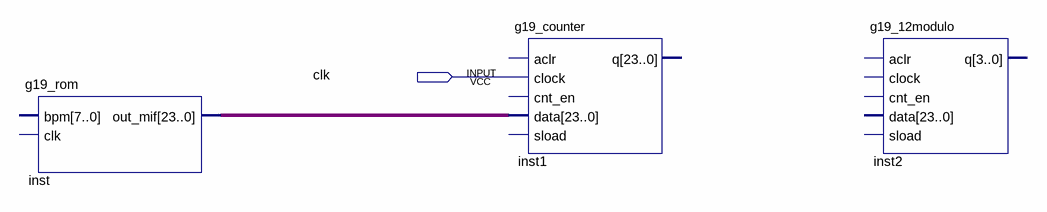
[diagram p0: schematic sheet]
// Quartus schematic g19_lab3.bdf as structural Verilog: 3 symbols, 1 pins
module g19_lab3 (
  input  clk
);

  wire [23:0] inst_out_mif;

  g19_rom inst (.out_mif(inst_out_mif));  // open: bpm, clk
  g19_counter inst1 (.clock(clk), .data(inst_out_mif));  // open: aclr, cnt_en, sload, q
  g19_12modulo inst2 ();  // open: aclr, clock, cnt_en, data, sload, q
endmodule
